# Altium schematic sheet Hall sensor cable.SchDoc
size A0; SheetNumber: 1; SheetTotal: 1
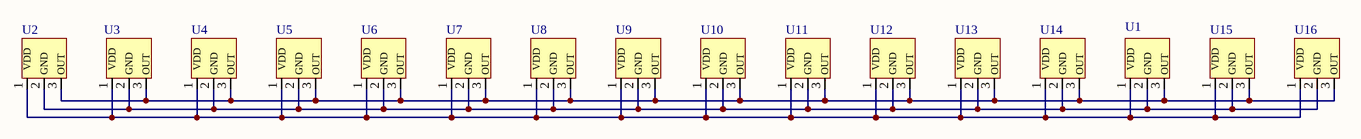
[diagram p0: Hall sensor cable.SchDoc]

## Parts
U1  U1881_Hall  [U1881]  (value not drawn)
U2  U1881_Hall  [U1881]  (value not drawn)
U3  U1881_Hall  [U1881]  (value not drawn)
U4  U1881_Hall  [U1881]  (value not drawn)
U5  U1881_Hall  [U1881]  (value not drawn)
U6  U1881_Hall  [U1881]  (value not drawn)
U7  U1881_Hall  [U1881]  (value not drawn)
U8  U1881_Hall  [U1881]  (value not drawn)
U9  U1881_Hall  [U1881]  (value not drawn)
U10  U1881_Hall  [U1881]  (value not drawn)
U11  U1881_Hall  [U1881]  (value not drawn)
U12  U1881_Hall  [U1881]  (value not drawn)
U13  U1881_Hall  [U1881]  (value not drawn)
U14  U1881_Hall  [U1881]  (value not drawn)
U15  U1881_Hall  [U1881]  (value not drawn)
U16  U1881_Hall  [U1881]  (value not drawn)

## Nets
NetU1_1: U1.1(VDD) U2.1(VDD) U3.1(VDD) U4.1(VDD) U5.1(VDD) U6.1(VDD) U7.1(VDD) U8.1(VDD) U9.1(VDD) U10.1(VDD) U11.1(VDD) U12.1(VDD) U13.1(VDD) U14.1(VDD) U15.1(VDD) U16.1(VDD)
NetU1_2: U1.2(GND) U2.2(GND) U3.2(GND) U4.2(GND) U5.2(GND) U6.2(GND) U7.2(GND) U8.2(GND) U9.2(GND) U10.2(GND) U11.2(GND) U12.2(GND) U13.2(GND) U14.2(GND) U15.2(GND) U16.2(GND)
NetU1_3: U1.3(OUT) U2.3(OUT) U3.3(OUT) U4.3(OUT) U5.3(OUT) U6.3(OUT) U7.3(OUT) U8.3(OUT) U9.3(OUT) U10.3(OUT) U11.3(OUT) U12.3(OUT) U13.3(OUT) U14.3(OUT) U15.3(OUT) U16.3(OUT)